# Altium schematic sheet Sheet1_MPU6050.SchDoc
size A4
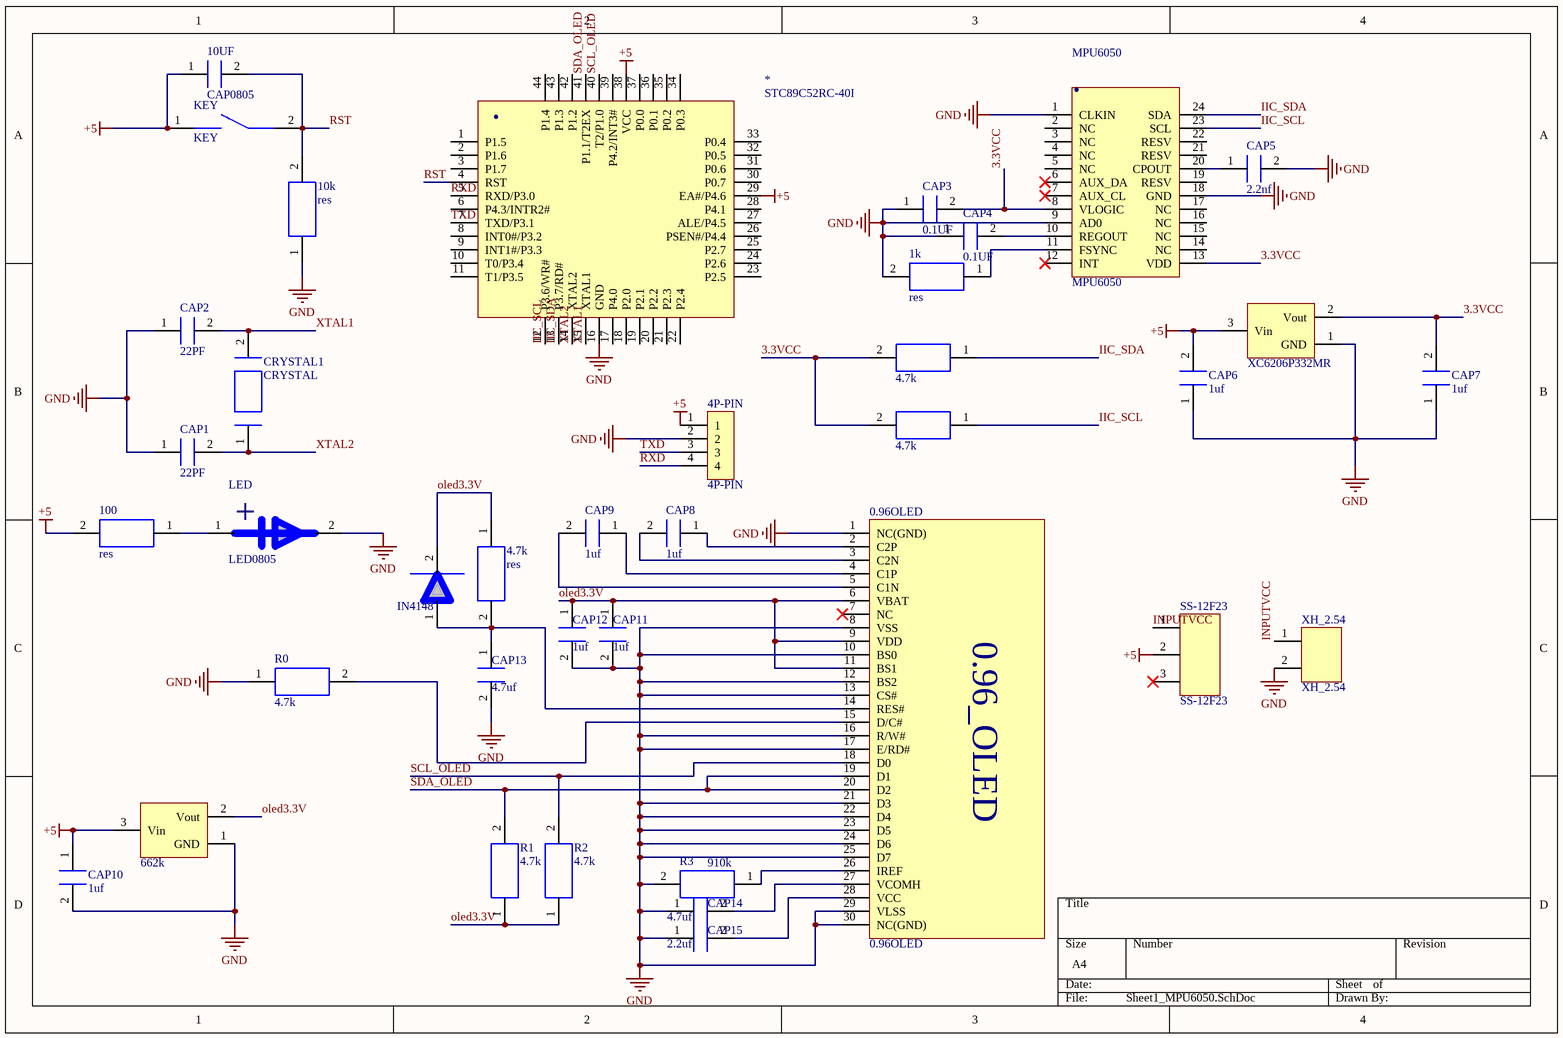
[diagram p0: Sheet1_MPU6050.SchDoc]

## Parts
0.96OLED  0.96OLED  [0.96OLED]
1k  res  [RES0805]
4.7k  res  [RES0805]
4P-PIN  4P-PIN  [4P_PIN]
10k  res  [RES0805]
10UF  CAP0805  [CAP0805]
100  res  [RES0805]
662k  662k  [XC6206P332MR]
*  STC89C52RC-40I  [STC89C52RC-40I]
CAP1  22PF  [CAP0805]
CAP2  22PF  [CAP0805]
CAP3  0.1UF  [CAP0805]
CAP4  0.1UF  [CAP0805]
CAP5  2.2nf  [CAP0805]
CAP6  1uf  [CAP0805]
CAP7  1uf  [CAP0805]
CAP8  1uf  [CAP0805]
CAP9  1uf  [CAP0805]
CAP10  1uf  [CAP0805]
CAP11  1uf  [CAP0805]
CAP12  1uf  [CAP0805]
CAP13  4.7uf  [CAP0805]
CAP14  4.7uf  [CAP0805]
CAP15  2.2uf  [CAP0805]
CRYSTAL1  CRYSTAL  [晶振]
IN4148  IN4148  [IN4148]  (value not drawn)
KEY  KEY  [KEY]
LED  LED0805  [LED0805]
MPU6050  MPU6050  [MPU6050]
R0  4.7k  [RES0805]
R1  4.7k  [RES0805]
R2  4.7k  [RES0805]
R3  910k  [RES0805]
res1  4.7k  [RES0805]
res2  4.7k  [RES0805]
SS-12F23  SS-12F23  [拨动开关SS-12F23]
XC6206P332MR  XC6206P332MR  [XC6206P332MR]
XH_2.54  XH_2.54  [XH_2.54]

## Nets
+5: 4P-PIN.1 10UF.1 100.2 662k.3(Vin) *.29(EA#/P4.6) *.38(VCC) CAP6.2 CAP10.1 KEY.1 SS-12F23.2 XC6206P332MR.3(Vin)
GND: 0.96OLED.1(NC(GND)) 0.96OLED.8(VSS) 0.96OLED.10(BS0) 0.96OLED.12(BS2) 0.96OLED.13(CS#) 0.96OLED.16(R/W#) 0.96OLED.17(E/RD#) 0.96OLED.21(D3) 0.96OLED.22(D4) 0.96OLED.23(D5) 0.96OLED.24(D6) 0.96OLED.25(D7) 0.96OLED.29(VLSS) 0.96OLED.30(NC(GND)) 1k.2 4P-PIN.2 10k.1 662k.1(GND) *.16(GND) CAP1.1 CAP2.1 CAP3.1 CAP4.1 CAP5.2 CAP6.1 CAP7.1 CAP10.2 CAP11.2 CAP12.2 CAP13.2 CAP14.1 CAP15.1 LED.2 MPU6050.1(CLKIN) MPU6050.9(AD0) MPU6050.18(GND) R0.1 R3.2 XC6206P332MR.1(GND) XH_2.54.2
3.3VCC: CAP3.2 CAP7.2 MPU6050.8(VLOGIC) MPU6050.13(VDD) res1.2 res2.2 XC6206P332MR.2(Vout)
IIC_SCL: *.12(P3.6/WR#) MPU6050.23(SCL) res2.1
IIC_SDA: *.13(P3.7/RD#) MPU6050.24(SDA) res1.1
INPUTVCC: SS-12F23.1 XH_2.54.1
oled3.3V: 0.96OLED.6(VBAT) 0.96OLED.9(VDD) 0.96OLED.11(BS1) 4.7k.1 662k.2(Vout) CAP11.1 CAP12.1 IN4148.2 R1.1 R2.1
RST: 10k.2 10UF.2 *.4(RST) KEY.2
RXD: 4P-PIN.4 *.5(RXD/P3.0)
SCL_OLED: 0.96OLED.18(D0) *.40(T2/P1.0) R2.2
SDA_OLED: 0.96OLED.19(D1) 0.96OLED.20(D2) *.41(P1.1/T2EX) R1.2
TXD: 4P-PIN.3 *.7(TXD/P3.1)
XTAL1: *.15(XTAL1) CAP2.2 CRYSTAL1.2
XTAL2: *.14(XTAL2) CAP1.2 CRYSTAL1.1
Net0.96OLED_2: 0.96OLED.2(C2P) CAP8.1
Net0.96OLED_3: 0.96OLED.3(C2N) CAP8.2
Net0.96OLED_4: 0.96OLED.4(C1P) CAP9.1
Net0.96OLED_5: 0.96OLED.5(C1N) CAP9.2
Net0.96OLED_14: 0.96OLED.14(RES#) 4.7k.2 CAP13.1 IN4148.1
Net0.96OLED_15: 0.96OLED.15(D/C#) R0.2
Net0.96OLED_26: 0.96OLED.26(IREF) R3.1
Net0.96OLED_27: 0.96OLED.27(VCOMH) CAP14.2
Net0.96OLED_28: 0.96OLED.28(VCC) CAP15.2
Net1k_1: 1k.1 MPU6050.11(FSYNC)
Net100_1: 100.1 LED.1
NetCAP4_2: CAP4.2 MPU6050.10(REGOUT)
NetCAP5_1: CAP5.1 MPU6050.20(CPOUT)

Not connected (* = marked no-connect by the designer): 0.96OLED 7(NC)*; * 1(P1.5) 2(P1.6) 3(P1.7) 6(P4.3/INTR2#) 8(INT0#/P3.2) 9(INT1#/P3.3) 10(T0/P3.4) 11(T1/P3.5) 17(P4.0) 18(P2.0) 19(P2.1) 20(P2.2) 21(P2.3) 22(P2.4) 23(P2.5) 24(P2.6) 25(P2.7) 26(PSEN#/P4.4) 27(ALE/P4.5) 28(P4.1) 30(P0.7) 31(P0.6) 32(P0.5) 33(P0.4) 34(P0.3) 35(P0.2) 36(P0.1) 37(P0.0) 39(P4.2/INT3#) 42(P1.2) 43(P1.3) 44(P1.4); MPU6050 2(NC) 3(NC) 4(NC) 5(NC) 6(AUX_DA)* 7(AUX_CL)* 12(INT)* 14(NC) 15(NC) 16(NC) 17(NC) 19(RESV) 21(RESV) 22(RESV); SS-12F23 3*

## Notes on the sheet
- (in symbol 0.96OLED) 0.96_OLED
- (in symbol LED0805) +
- (in symbol MPU6050) .
- (in symbol STC89C52RC-40I) .

## Library data of the parts
1k 4.7k 10k 100 R0-R3 res1 res2 = RES0805
662k = XC6206P332MR
CAP1-CAP15 = CAP0805
CRYSTAL1 = 晶振
SS-12F23 = 拨动开关SS-12F23